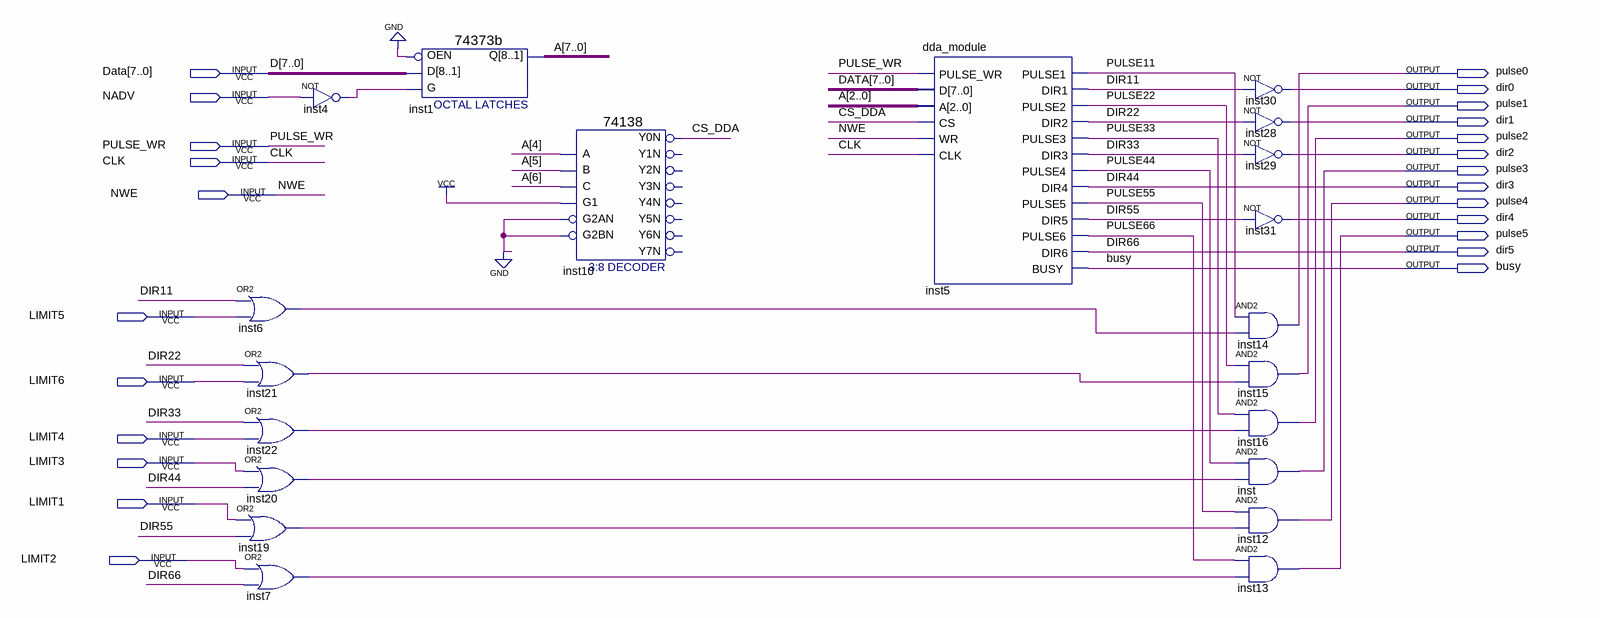
[diagram p0: schematic sheet]
// Quartus schematic xuat_xung.bdf as structural Verilog: 20 symbols, 24 pins
module xuat_xung (
  input  [7:0] Data,
  input  NADV,
  input  PULSE_WR,
  input  CLK,
  input  NWE,
  input  LIMIT5,
  input  LIMIT6,
  input  LIMIT4,
  input  LIMIT3,
  input  LIMIT1,
  input  LIMIT2,
  output pulse0,
  output dir0,
  output pulse1,
  output dir1,
  output pulse2,
  output dir2,
  output pulse3,
  output dir3,
  output pulse4,
  output dir4,
  output pulse5,
  output dir5,
  output busy
);

  wire CS_DDA, DIR11, DIR22, DIR33, DIR55, inst4_out, inst6_out, inst7_out, inst19_out, inst20_out,
       inst21_out, inst22_out, PULSE11, PULSE22, PULSE33, PULSE44, PULSE55, PULSE66;
  wire [7:0] A;

  or inst6 (inst6_out, DIR11, LIMIT5);
  or inst21 (inst21_out, DIR22, LIMIT6);
  or inst22 (inst22_out, DIR33, LIMIT4);
  or inst20 (inst20_out, LIMIT3, dir3);
  or inst19 (inst19_out, LIMIT1, DIR55);
  or inst7 (inst7_out, LIMIT2, dir5);
  not inst4 (inst4_out, NADV);
  \74373b  inst1 (.D(Data), .G(inst4_out), .OEN(1'b0), .Q(A));
  \74138  inst10 (
    .A(A[4]), .B(A[5]), .G1(1'b1), .C(A[6]), .G2AN(1'b0), .G2BN(1'b0), .Y0N(CS_DDA));  // open: Y1N, Y2N, Y3N, Y4N, Y5N, Y6N, Y7N
  dda_module inst5 (
    .A(A[2:0]), .CS(CS_DDA), .WR(NWE), .CLK(CLK), .D(Data), .PULSE_WR(PULSE_WR), .PULSE1(PULSE11),
    .DIR1(DIR11), .PULSE2(PULSE22), .DIR2(DIR22), .PULSE3(PULSE33), .DIR3(DIR33), .PULSE4(PULSE44),
    .DIR4(dir3), .PULSE5(PULSE55), .DIR5(DIR55), .PULSE6(PULSE66), .DIR6(dir5), .BUSY(busy));
  not inst30 (dir0, DIR11);
  not inst28 (dir1, DIR22);
  not inst29 (dir2, DIR33);
  not inst31 (dir4, DIR55);
  and inst14 (pulse0, PULSE11, inst6_out);
  and inst15 (pulse1, PULSE22, inst21_out);
  and inst16 (pulse2, PULSE33, inst22_out);
  and inst (pulse3, PULSE44, inst20_out);
  and inst12 (pulse4, PULSE55, inst19_out);
  and inst13 (pulse5, PULSE66, inst7_out);

  // Other names for the same wires on the sheet: D[7:0] = Data; DIR44 = dir3; DIR66 = dir5
endmodule
